# Altium schematic sheet ADC.SchDoc
size A; SheetNumber: 5; SheetTotal: 14
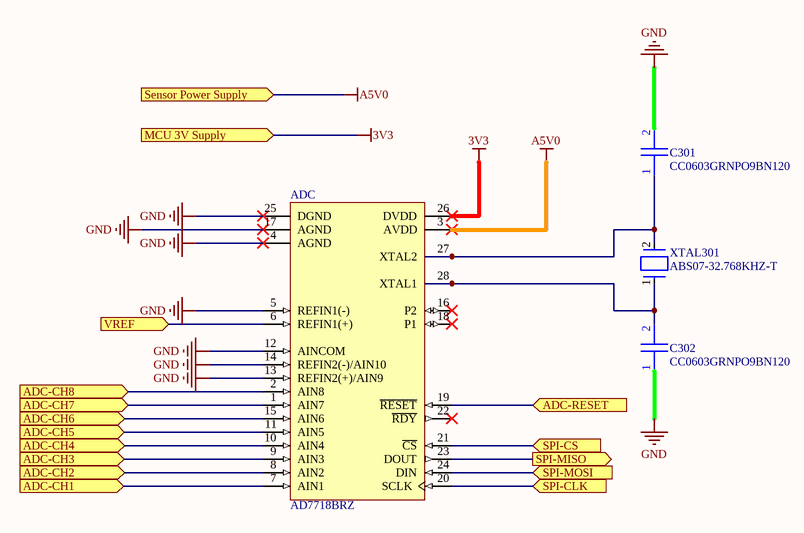
[diagram p0: ADC.SchDoc]

## Parts
ADC  AD7718BRZ  [RW-28_L]
C301  CC0603GRNPO9BN120  [CC0603GRNPO9BN120]
C302  CC0603GRNPO9BN120  [CC0603GRNPO9BN120]
XTAL301  ABS07-32.768KHZ-T  [FP-ABS07-MFG]

## Ports
ADC-CH1 (in, see PCB-Schematic[3A]), ADC-CH2 (in, see PCB-Schematic[3A]), ADC-CH3 (in, see PCB-Schematic[3B]), ADC-CH4 (in, see PCB-Schematic[3B]), ADC-CH5 (in, see PCB-Schematic[3B]), ADC-CH6 (in, see PCB-Schematic[3B]), ADC-CH7 (in, see PCB-Schematic[3B]), ADC-CH8 (in, see PCB-Schematic[3B]), ADC-RESET (in, see PCB-Schematic[4B]), MCU 3V Supply (in, see PCB-Schematic[4B]), Sensor Power Supply (in, see PCB-Schematic[4B], CurrentSense[2B], Thermistor[1A], VRB[2B]), SPI-CLK (in, see PCB-Schematic[4B]), SPI-CS (in, see PCB-Schematic[4A]), SPI-MISO (out, see PCB-Schematic[4B]), SPI-MOSI (in, see PCB-Schematic[4A]), VREF (in, see PCB-Schematic[4B], VRB[4C])

## Nets
3V3: ADC.26(DVDD) ; port MCU 3V Supply
A5V0: ADC.3(AVDD) ; port Sensor Power Supply
GND: ADC.4(AGND) ADC.5(REFIN1(-)) ADC.12(AINCOM) ADC.13(REFIN2(+)/AIN9) ADC.14(REFIN2(-)/AIN10) ADC.17(AGND) ADC.25(DGND) C301.2 C302.1
ADC-CH1: ADC.7(AIN1) ; port ADC-CH1
ADC-CH2: ADC.8(AIN2) ; port ADC-CH2
ADC-CH3: ADC.9(AIN3) ; port ADC-CH3
ADC-CH4: ADC.10(AIN4) ; port ADC-CH4
ADC-CH5: ADC.11(AIN5) ; port ADC-CH5
ADC-CH6: ADC.15(AIN6) ; port ADC-CH6
ADC-CH7: ADC.1(AIN7) ; port ADC-CH7
ADC-CH8: ADC.2(AIN8) ; port ADC-CH8
ADC-RESET: ADC.19(~{RESET}) ; port ADC-RESET
SPI-CLK: ADC.20(SCLK) ; port SPI-CLK
SPI-CS: ADC.21(~{CS}) ; port SPI-CS
SPI-MISO: ADC.23(DOUT) ; port SPI-MISO
SPI-MOSI: ADC.24(DIN) ; port SPI-MOSI
VREF: ADC.6(REFIN1(+)) ; port VREF
NetADC_27: ADC.27(XTAL2) C301.1 XTAL301.2
NetADC_28: ADC.28(XTAL1) C302.2 XTAL301.1

Not connected (* = marked no-connect by the designer): ADC 16(P2)* 18(P1)* 22(~{RDY})*

## Library data of the parts
ADC = CMP-0313-01290-2: 10 Channel 24-Bit Low Power Sigma-Delta Analog-to-Digital Converter with Serial, SPI Interface, 1.365KSPS, -40 to +85 degC, RW-28, Pb-Free, Tube; Generic Part Number: AD7718; Manufacturer: Analog Devices; Channels: 10; Throughput Rate (SPS): 1.365K; Interface: Ser, SPI; Resolution (Bits): 24; ComponentLink1URL: http://www.analog.com/en/index.html; ComponentLink2URL: http://www.analog.com/static/imported-files/data_sheets/AD7708_7718.pdf; Packing: Tube; ComponentLink4URL: http://www.analog.com/en/analog-to-digital-converters/ad-converters/ad7718/products/product.html; PackageDescription: 28-Lead Standard Small Outline Package [SOIC_W]; ComponentLink1Description: Manufacturer URL; ComponentLink2Description: Datasheet; PackageVersion: 060706-A; ComponentLink4Description: Product URL; ComponentLink3Description: Package Specification; ComponentLink3URL: http://www.analog.com/static/imported-files/packages/35833120341221RW_28.pdf; RoHS: Y; DatasheetVersion: Rev.0; PackageReference: RW-28; Mounting Technology: Surface Mount; PartNumber: AD7718BRZ; Code_JEDEC: MS-013-AE
C301 C302 = CC0603GRNPO9BN120: 12pF 50V
XTAL301 = CMP-0447-00001-4: Crystal 32.768kHz ±20ppm (Tol) 12.5pF FUND 70kΩ 2-Pin CSMD T/R; ESR (Equivalent Series Resistance): 70kR; Radiation Hardening: No; Frequency: 32.768kHz; Length: 3.2mm; Max Operating Temperature: 85°C; Number of Pins: 2; Series: ABS07; Min Operating Temperature: -40°C; Frequency Tolerance: 20ppm; Packaging: Tape and Reel; Height: 0.9mm; Width: 1.5mm; Depth: 1.5mm; Load Capacitance: 12.5pF; RoHS Compliant: Yes; Tolerance: 20ppm; Termination: SMD/SMT; Lead Free: Lead Free; Series Resistance: 70kR; REACH SVHC: No SVHC; Case/Package: CSMD; Operating Frequency: 32.768 kHz; Package Quantity: 3000